# EAGLE design Satellite (EAGLE 5.11)
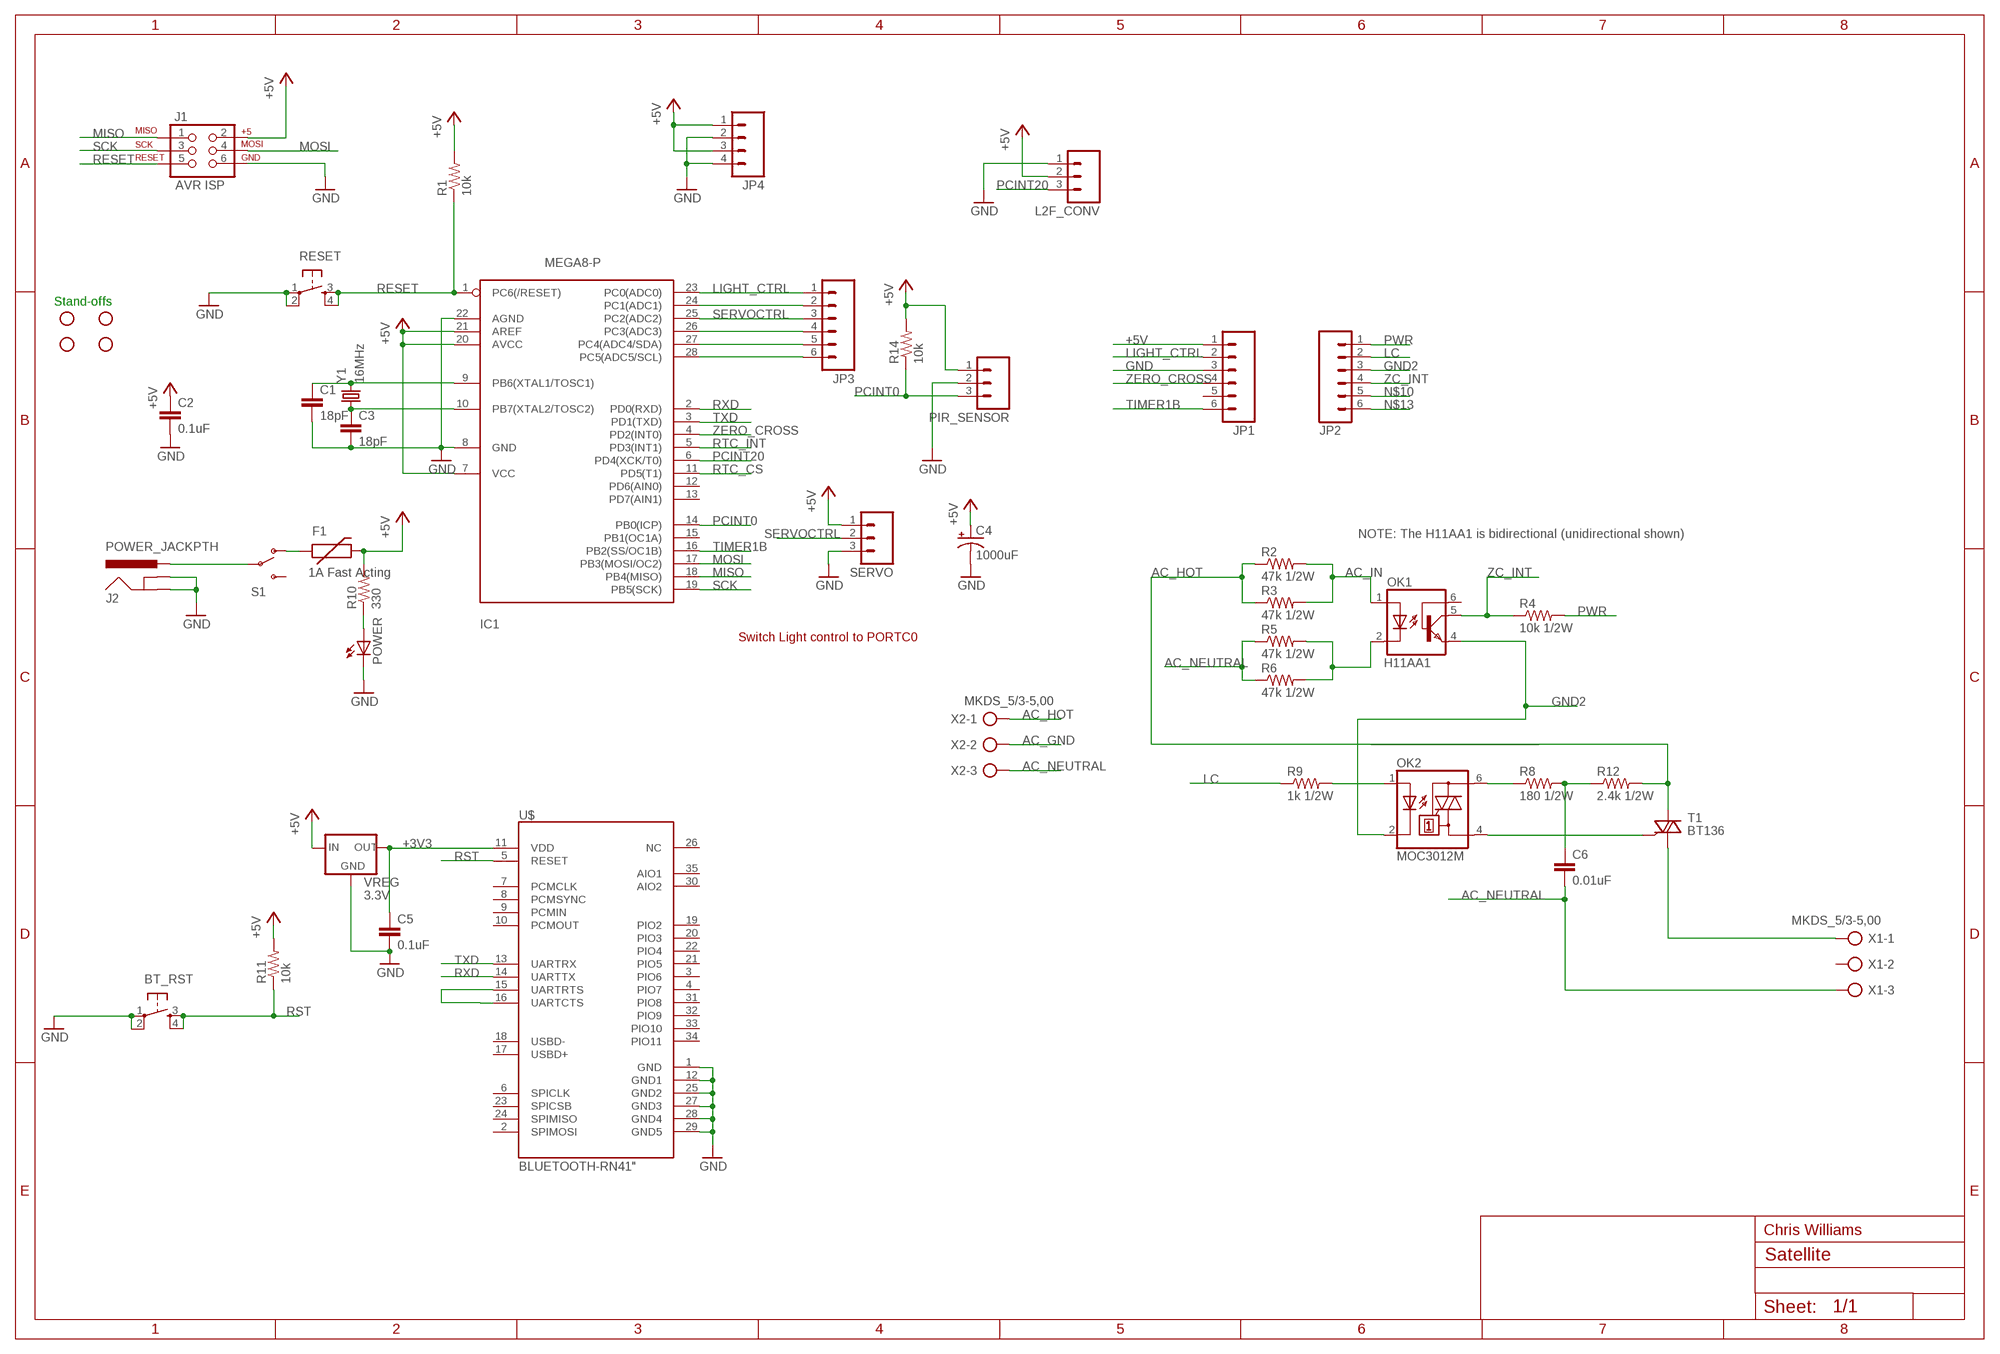
[diagram p0: schematic, sheet 1]

## Parts
BT_RST  TAC_SWITCHPTH  [TACTILE-PTH]
C1  18pF  CAPPTH2  [CAP-PTH-SMALL2]
C2  0.1uF  CAPPTH2  [CAP-PTH-SMALL2]
C3  18pF  CAPPTH2  [CAP-PTH-SMALL2]
C4  1000uF  CPOL-USE7.5-16  [E7,5-16]
C5  0.1uF  CAPPTH2  [CAP-PTH-SMALL2]
C6  0.01uF  C5/5  [C5B5]
F1  1A Fast Acting  PTCPTH  [PTC]
IC1  MEGA8-P  [DIL28-3]
J1  AVR ISP  AVR_SPI_PRG_6PTH  [2X3]
J2  POWER_JACKPTH  [POWER_JACK_PTH]
JP1  M06SIP  [1X06]
JP2  M06SIP  [1X06]
JP3  M06SIP  [1X06]
JP4  M04PTH  [1X04]
JP5  STAND-OFF  [STAND-OFF]
JP6  STAND-OFF  [STAND-OFF]
JP7  STAND-OFF  [STAND-OFF]
JP8  STAND-OFF  [STAND-OFF]
L2F_CONV  M03PTH  [1X03]
OK1  4N25M  [DIL06]
OK2  MOC3012M  [DIL06]
PIR_SENSOR  M03PTH  [1X03]
POWER  LED3MM  [LED3MM]
R1  10k  RESISTORPTH-1/4W  [AXIAL-0.4]
R2  47k 1/2W  RESISTORPTH-1/2W  [AXIAL-0.5]
R3  47k 1/2W  RESISTORPTH-1/2W  [AXIAL-0.5]
R4  10k 1/2W  RESISTORPTH-1/2W  [AXIAL-0.5]
R5  47k 1/2W  RESISTORPTH-1/2W  [AXIAL-0.5]
R6  47k 1/2W  RESISTORPTH-1/2W  [AXIAL-0.5]
R8  180 1/2W  RESISTORPTH-1/2W  [AXIAL-0.5]
R9  1k 1/2W  RESISTORPTH-1/2W  [AXIAL-0.5]
R10  330  RESISTORPTH-1/4W  [AXIAL-0.4]
R11  10k  RESISTORPTH-1/4W  [AXIAL-0.4]
R12  2.4k 1/2W  RESISTORPTH-1/2W  [AXIAL-0.5]
R14  10k  RESISTORPTH-1/4W  [AXIAL-0.4]
RESET  TAC_SWITCHPTH  [TACTILE-PTH]
S1  SWITCH-SPSTKIT  [SWITCH-SPDT_KIT]
SERVO  M03PTH  [1X03]
T1  BT136  [TO220AB]
U$  BLUETOOTH-RN41"  [RN41]
VREG  3.3V  V_REG_78XXSIDE  [78XXL]
X1  MKDS_5/3-5,00  [MKDS_5/3-500]
X2  MKDS_5/3-5,00  [MKDS_5/3-500]
Y1  16MHz  CRYSTALHC49US  [HC49US]

## Nets
+3V3: C5.1 U$.11(VDD) VREG.OUT
+5V: C2.1 C4.+ F1.P$2 IC1.7(VCC) IC1.20(AVCC) IC1.21(AREF) J1.2 JP1.1 JP4.1 JP4.3 L2F_CONV.2 PIR_SENSOR.1 R1.P$2 R10.P$2 R11.P$2 R14.P$2 SERVO.1 VREG.IN
AC1 [AC_HOT]: OK2.6(A2) R8.P$1
AC2 [AC_HOT]: C6.1 R8.P$2 R12.P$1
AC_GND: X2.2
AC_HOT [AC_HOT]: R2.P$1 R3.P$1 R12.P$2 T1.2(A2) X2.1
AC_IN [AC_HOT]: OK1.1(A) R2.P$2 R3.P$2
AC_NEUTRAL [AC_HOT]: C6.2 R5.P$1 R6.P$1 X1.3 X2.3
AC_OUT [AC_HOT]: T1.1(A1) X1.1
GND: BT_RST.1 BT_RST.2 C1.2 C2.2 C3.2 C4.- C5.2 IC1.8(GND) IC1.22(AGND) J1.6 J2.GND J2.GNDBREAK JP1.3 JP4.2 JP4.4 L2F_CONV.1 PIR_SENSOR.2 POWER.K(C) RESET.1 RESET.2 SERVO.3 U$.1(GND) U$.12(GND1) U$.25(GND2) U$.27(GND3) U$.28(GND4) U$.29(GND5) VREG.GND
GND2: JP2.3 OK1.4(EMI) OK2.2(C)
LC: JP2.2 R9.P$1
LIGHT_CTRL: IC1.23(PC0(ADC0)) JP1.2 JP3.1
MISO: IC1.18(PB4(MISO)) J1.1
MOSI: IC1.17(PB3(MOSI/OC2)) J1.4
N$1: IC1.24(PC1(ADC1)) JP3.2
N$2: J2.PWR S1.2(P)
N$5: C3.1 IC1.10(PB7(XTAL2/TOSC2)) Y1.1
N$6: C1.1 IC1.9(PB6(XTAL1/TOSC1)) Y1.2
N$8: OK2.4(A1) T1.3(G)
N$10: JP2.5
N$13: JP2.6
N$15: IC1.26(PC3(ADC3)) JP3.4
N$18: F1.P$1 S1.1(O)
N$19: POWER.A R10.P$1
N$21: IC1.27(PC4(ADC4/SDA)) JP3.5
N$22: IC1.28(PC5(ADC5/SCL)) JP3.6
N$29: OK2.1(A) R9.P$2
NEUT_IN [AC_HOT]: OK1.2(C) R5.P$2 R6.P$2
PCINT0: IC1.14(PB0(ICP)) PIR_SENSOR.3 R14.P$1
PCINT20: IC1.6(PD4(XCK/T0)) L2F_CONV.3
PWR: JP2.1 R4.P$2
RESET: IC1.1(PC6(/RESET)) J1.5 R1.P$1 RESET.3 RESET.4
RST: BT_RST.3 BT_RST.4 R11.P$1 U$.5(RESET)
RTC_CS: IC1.11(PD5(T1))
RTC_INT: IC1.5(PD3(INT1))
RTS: U$.15(UARTRTS) U$.16(UARTCTS)
RXD: IC1.2(PD0(RXD)) U$.14(UARTTX)
SCK: IC1.19(PB5(SCK)) J1.3
SERVOCTRL: IC1.25(PC2(ADC2)) JP3.3 SERVO.2
TIMER1B: IC1.16(PB2(SS/OC1B)) JP1.6
TXD: IC1.3(PD1(TXD)) U$.13(UARTRX)
ZC_INT: JP2.4 OK1.5(COL) R4.P$1
ZERO_CROSS: IC1.4(PD2(INT0)) JP1.4
Unconnected: IC1.12(PD6(AIN0)) IC1.13(PD7(AIN1)) IC1.15(PB1(OC1A)) JP1.5 OK1.6(BAS) S1.3(S) U$.2(SPIMOSI) U$.3(PIO6) U$.4(PIO7) U$.6(SPICLK) U$.7(PCMCLK) U$.8(PCMSYNC) U$.9(PCMIN) U$.10(PCMOUT) U$.17(USBD+) U$.18(USBD-) U$.19(PIO2) U$.20(PIO3) U$.21(PIO5) U$.22(PIO4) U$.23(SPICSB) U$.24(SPIMISO) U$.26(NC) U$.30(AIO2) U$.31(PIO8) U$.32(PIO9) U$.33(PIO10) U$.34(PIO11) U$.35(AIO1) X1.2

## Notes on the sheet
- Stand-offs
- NOTE: The H11AA1 is bidirectional (unidirectional shown)
- Switch Light control to PORTC0
- H11AA1
- Chris Williams

## Library data of the parts
BT_RST RESET = SparkFun:TAC_SWITCH: Momentary Switch Button commonly used for reset or general input. Spark Fun Electronics SKU : COM-00097
C1-C3 C5 = SparkFun:CAP: Capacitor Standard 0603 ceramic capacitor, and 0.1" leaded capacitor.
C4 = rcl:CPOL-US: POLARIZED CAPACITOR, American symbol
C6 = capacitor-wima:C: CAPACITOR naming: grid - package width
F1 = SparkFun:PTC: Resettable Fuse PTC Resettable Fuse. Spark Fun Electronics SKU : COM-08357
IC1 = atmel:MEGA8-P: MICROCONTROLLER 8 Kbytes FLASH, 1 kbytes SRAM, 512 bytes EEPROM, USART, 4-channel 10 bit ADC, 2-channel 8 bit ADC Pin compatible with Atmega48, ATMega88, ATMega168 Source: avr.lbr
J1 = SparkFun:AVR_SPI_PRG_6: AVR ISP 6 Pin This is the reduced ISP connector for AVR programming. Common on Arduino. This footprint will take up less PCB space and can be used with a 10-pin to 6-pin adapter such as SKU: BOB-08508
J2 = SparkFun:POWER_JACK: Power Jack This is the standard 5.5mm barrel jack for power. The PTH is the most common, proven, reliable, footprint. All others are experimental. The Slot footprint only works if the mill layer is transmitted to the PCB fab house so be warned. Spark Fun Electronics SKU : PRT-00119. Mating wall wart : TOL-00298 (and others)
JP1-JP3 = SparkFun:M06: Header 6 Standard 6-pin 0.1" header. Use with straight break away headers (SKU : PRT-00116), right angle break away headers (PRT-00553), swiss pins (PRT-00743), machine pins (PRT-00117), and female headers (PRT-00115). Molex polarized connector foot print use with SKU : PRT-08094 with associated crimp pins and housings. NOTES ON THE VARIANTS LOCK and LOCK_LONGPADS... This footprint was designed to help hold the alignment of a through-hole component (i.e. 6-pin header) while soldering it into place. You may notice that each hole has been shifted either up or down by 0.005 of an inch from it's more standard position (which is a perfectly straight line). This slight alteration caused the pins (the squares in the middle) to touch the edges of the holes. Because they are alternating, it causes a "brace" to hold the component in place. 0.005 has proven to be the perfect amount of "off-center" position when using our standard breakaway headers. Although looks a little odd when you look at the bare footprint, once you have a header in there, the alteration is very hard to notice. Also, if you push a header all the way into place, it is covered up entirely on the bottom side. This idea of altering the position of holes to aid alignment will be further integrated into the Sparkfun Library for other footprints. It can help hold any component with 3 or more connection pins.
JP4 = SparkFun:M04: Header 4 Standard 4-pin 0.1" header. Use with straight break away headers (SKU : PRT-00116), right angle break away headers (PRT-00553), swiss pins (PRT-00743), machine pins (PRT-00117), and female headers (PRT-00115). Molex polarized connector foot print use with SKU : PRT-08231 with associated crimp pins and housings. 1MM SMD Version SKU: PRT-10208
JP5-JP8 = SparkFun:STAND-OFF: Stand Off This is the mechanical footprint for a #4 phillips button head screw. Use the keepout ring to avoid running the screw head into surrounding components. SKU : PRT-00447
L2F_CONV PIR_SENSOR SERVO = SparkFun:M03: Header 3 Standard 3-pin 0.1" header. Use with straight break away headers (SKU : PRT-00116), right angle break away headers (PRT-00553), swiss pins (PRT-00743), machine pins (PRT-00117), and female headers (PRT-00115). Molex polarized connector foot print use with SKU : PRT-08232 with associated crimp pins and housings.
OK1 = optocoupler:4N*?M: General Purpose 6-Pin Phototransistor Optocouplers Source: http://www.fairchildsemi.com/ds/4N/4N35-M.pdf; MPN: 4N25-M; OC_FARNELL: 1021349; OC_NEWARK: 98K9084
OK2 = optocoupler:MOC30*M: RANDOM-PHASE OPTOISOLATORS TRIAC DRIVER OUTPUT Source: http://www.fairchildsemi.com MOC3020-M.pdf; MF: FAIRCHILD SEMICONDUCTOR; MPN: MOC3012-M; OC_FARNELL: 1021364; OC_NEWARK: 72K8894
POWER = led:LED: LED OSRAM: - CHIPLED LG R971, LG N971, LY N971, LG Q971, LY Q971, LO R971, LY R971 LH N974, LH R974 LS Q976, LO Q976, LY Q976 LO Q996 - Hyper CHIPLED LW Q18S LB Q993, LB Q99A, LB R99A - SideLED LS A670, LO A670, LY A670, LG A670, LP A670 LB A673, LV A673, LT A673, LW A673 LH A674 LY A675 LS A676, LA A676, LO A676, LY A676, LW A676 LS A679, LY A679, LG A679 - Hyper Micro SIDELED® LS Y876, LA Y876, LO Y876, LY Y876 LT Y87S - SmartLED LW L88C, LW L88S LB L89C, LB L89S, LG L890 LS L89K, LO L89K, LY L89K LS L896, LA L896, LO L896, LY L896 - TOPLED LS T670, LO T670, LY T670, LG T670, LP T670 LSG T670, LSP T670, LSY T670, LOP T670, LYG T670 LG T671, LOG T671, LSG T671 LB T673, LV T673, LT T673, LW T673 LH T674 LS T676, LA T676, LO T676, LY T676, LB T676, LH T676, LSB T676, LW T676 LB T67C, LV T67C, LT T67C, LS T67K, LO T67K, LY T67K, LW E67C LS E67B, LA E67B, LO E67B, LY E67B, LB E67C, LV E67C, LT E67C LW T67C LS T679, LY T679, LG T679 LS T770, LO T770, LY T770, LG T770, LP T770 LB T773, LV T773, LT T773, LW T773 LH T774 LS E675, LA E675, LY E675, LS T675 LS T776, LA T776, LO T776, LY T776, LB T776 LHGB T686 LT T68C, LB T68C - Hyper Mini TOPLED® LB M676 - Mini TOPLED Santana® LG M470 LS M47K, LO M47K, LY M47K Source: http://www.osram.convergy.de LUXEON: - LUMILED® LXK2-PW12-R00, LXK2-PW12-S00, LXK2-PW14-U00, LXK2-PW14-V00 LXK2-PM12-R00, LXK2-PM12-S00, LXK2-PM14-U00 LXK2-PE12-Q00, LXK2-PE12-R00, LXK2-PE12-S00, LXK2-PE14-T00, LXK2-PE14-U00 LXK2-PB12-K00, LXK2-PB12-L00, LXK2-PB12-M00, LXK2-PB14-N00, LXK2-PB14-P00, LXK2-PB14-Q00 LXK2-PR12-L00, LXK2-PR12-M00, LXK2-PR14-Q00, LXK2-PR14-R00 LXK2-PD12-Q00, LXK2-PD12-R00, LXK2-PD12-S00 LXK2-PH12-R00, LXK2-PH12-S00 LXK2-PL12-P00, LXK2-PL12-Q00, LXK2-PL12-R00 Source: www.luxeon.com KINGBRIGHT: KA-3528ASYC Source: www.kingbright.com
R1-R6 R8-R12 R14 = SparkFun:RESISTOR: Resistor Basic schematic elements and footprints for 0603, 1206, and PTH resistors.
S1 = SparkFun:SWITCH-SPST: SPST Switch Simple slide switch. Spark Fun Electronics SKU : COM-00102
T1 = triac:BT136: Triac BT136 series E sensitive gate Source: http://www.nxp.com/acrobat_download/datasheets/BT136_SERIES_E_2.pdf
U$ = SparkFun:BLUETOOTH-RN41
VREG = SparkFun:V_REG_78XX: Voltage Regulator Standard 7805 5V regulator. IGO (Input Ground Output). Spark Fun Electronics SKU : COM-00107
X1 X2 = con-phoenix-mkds_5:MKDS_5/3-: MKDS 5/3-6,35 Source: PHOENIX CONTACT
Y1 = SparkFun:CRYSTAL: Crystals Various standard crystals. Proven footprints. Spark Fun Electronics SKU : COM-00534

## Net classes
1 AC_HOT: width 0.813 mm, clearance 0.381 mm

## Board
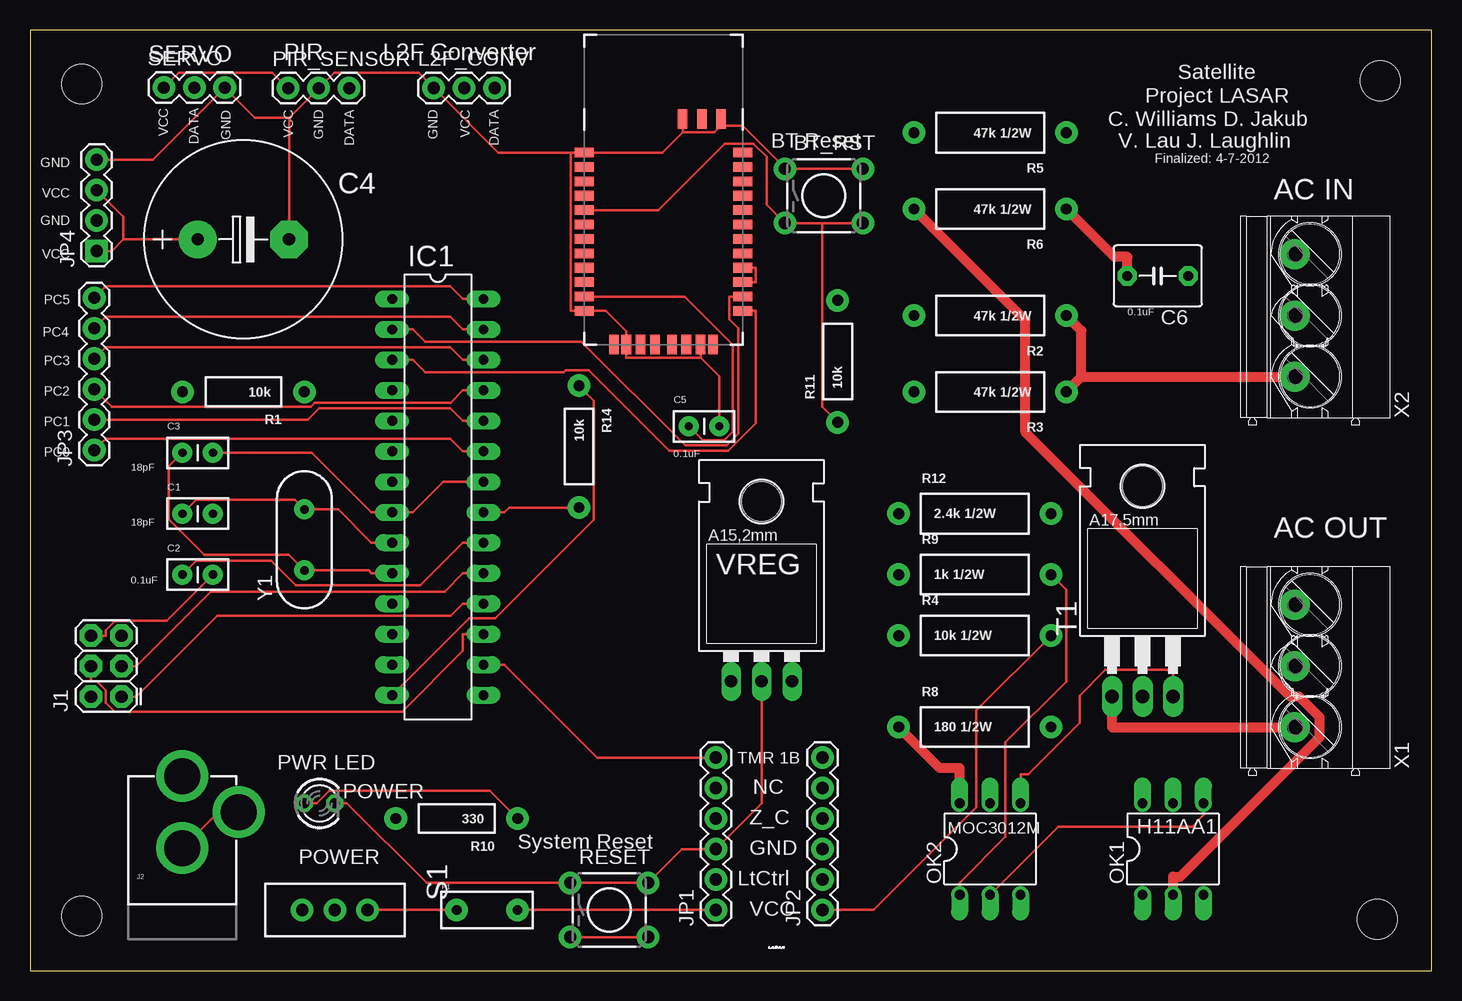
[diagram p1: board, top side]
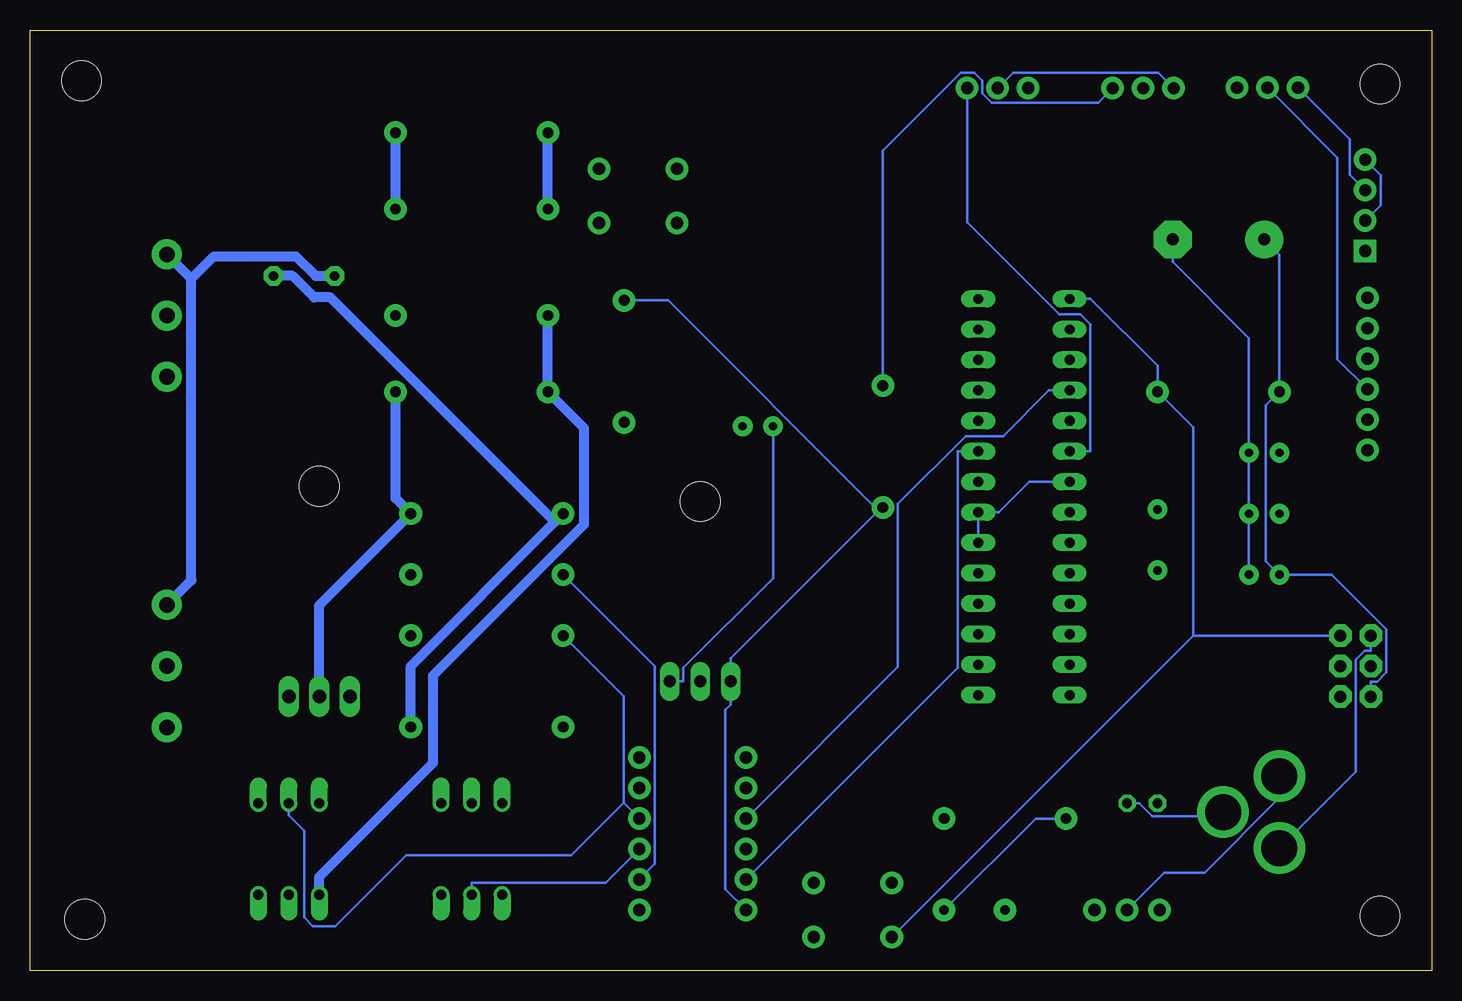
[diagram p2: board, bottom side, seen from below]

Size 116.82 x 78.41 mm. Coordinates in mm from the lower left corner, seen from the top.
Outline: 0,0 116.82,0 116.82,78.41 0,78.41 0,0
Copper layers (1*16): Top 0.035mm / dielectric 1.5mm / Bottom 0.035mm
Design rules "SparkFun": minimum track width 8mil, minimum drill 20mil, track to track 8mil, track to pad 8mil, pad to pad 8mil, via to via 8mil, smd to smd 8mil, copper to edge 10mil, drill to drill 8mil, minimum pad ring 12mil, minimum via ring 10mil, stop-mask expansion 4mil, vias tented up to drill 25mil, thermal gap 10mil

### Footprints (pad centres in the part's own frame; a part is rotated, then mirrored left to right if it is on the bottom)
TACTILE-PTH = drill 1.016 pad 1.88 round: 1 -3.251,2.261; 2 3.251,2.261; 3 -3.251,-2.261; 4 3.251,-2.261
CAP-PTH-SMALL2 = drill 0.7 pad 1.651 round: 1 0,0; 2 2.54,0
E7,5-16 = drill 1.016 pad 3.15 round: + -3.81,0 | drill 1.016 pad 3.15 octagon: - 3.81,0
C5B5 = drill 0.813 pad 1.6 octagon: 1 -2.54,0; 2 2.54,0
PTC = drill 0.8 pad 1.88 round: P$1 -2.54,0; P$2 2.54,0
DIL28-3 = drill 0.813 long: 1 -16.51,-3.81; 2 -13.97,-3.81; 3 -11.43,-3.81; 4 -8.89,-3.81; 5 -6.35,-3.81; 6 -3.81,-3.81; 7 -1.27,-3.81; 8 1.27,-3.81; 9 3.81,-3.81; 10 6.35,-3.81; 11 8.89,-3.81; 12 11.43,-3.81; 13 13.97,-3.81; 14 16.51,-3.81; 15 16.51,3.81; 16 13.97,3.81; 17 11.43,3.81; 18 8.89,3.81; 19 6.35,3.81; 20 3.81,3.81; 21 1.27,3.81; 22 -1.27,3.81; 23 -3.81,3.81; 24 -6.35,3.81; 25 -8.89,3.81; 26 -11.43,3.81; 27 -13.97,3.81; 28 -16.51,3.81
2X3 = drill 1.016 pad 1.88 octagon: 1 0,0; 2 0,2.54; 3 2.54,0; 4 2.54,2.54; 5 5.08,0; 6 5.08,2.54
POWER_JACK_PTH = drill 2.997 pad 4.318 round: GND 0,7.7; GNDBREAK 4.7,10.7; PWR 0,13.7
1X06 = drill 1.016 pad 1.88 round: 1 0,0; 2 2.54,0; 3 5.08,0; 4 7.62,0; 5 10.16,0; 6 12.7,0
1X04 = drill 1.016 pad 1.88 square: 1 0,0 | drill 1.016 pad 1.88 round: 2 2.54,0; 3 5.08,0; 4 7.62,0
STAND-OFF = hole 3.302: 0,0
1X03 = drill 1.016 pad 1.88 round: 1 0,0; 2 2.54,0; 3 5.08,0
DIL06 = drill 0.813 offset: 1 -2.54,-3.81; 2 0,-3.81; 3 2.54,-3.81; 4 2.54,3.81; 5 0,3.81; 6 -2.54,3.81
LED3MM = drill 0.813 octagon: A -1.27,0; K 1.27,0
AXIAL-0.4 = drill 0.9 pad 1.88 round: P$1 -5.08,0; P$2 5.08,0
AXIAL-0.5 = drill 0.9 pad 1.88 round: P$1 -6.35,0; P$2 6.35,0
SWITCH-SPDT_KIT = drill 1.016 pad 1.88 round: 1 0,2.718; 2 0,0; 3 0,-2.718
TO220AB = drill 1.118 long: 1 -2.54,-6.35; 2 0,-6.35; 3 2.54,-6.35 | hole 3.302: 0,11.176
RN41 = smd 0.8 x 1.6: 1 -6.6,-6.6; 2 -5.4,-6.6; 3 -4.2,-6.6; 4 -3,-6.6; 5 -1.8,-6.6; 6 -0.6,-6.6; 7 0.6,-6.6; 8 1.8,-6.6; 9 3,-6.6; 10 4.2,-6.6; 11 5.4,-6.6; 12 6.6,-6.6; 13 6.6,6.6; 14 5.4,6.6; 15 4.2,6.6; 16 3,6.6; 17 1.8,6.6; 18 0.6,6.6; 19 -0.6,6.6; 20 -1.8,6.6; 21 -3,6.6; 22 -4.2,6.6; 23 -5.4,6.6; 24 -6.6,6.6 | smd 1.6 x 0.8: 25 -9.4,4.8; 26 -9.4,3.2; 27 -9.4,1.6; 28 9.4,3.1; 29 9.4,-3.1; 30 9.4,-4.122; 31 9.4,-1.9; 32 9.4,-0.7; 33 9.4,0.7; 34 9.4,1.9; 35 9.4,4.122
78XXL = drill 1.016 long: GND 0,-3.81; IN -2.54,-3.81; OUT 2.54,-3.81 | hole 3.302: 0,11.176
MKDS_5/3-500 = drill 1.3 pad 2.5 round: 1 -5.1,1.27; 2 0,1.27; 3 5.1,1.27
HC49US = drill 0.7 pad 1.651 round: 1 -2.54,0; 2 2.54,0

### Placement (x,y rotation side)
BT_RST  66.15,64.58 0 top
C1  12.7,38.1 0 top
C2  12.7,33.02 0 top
C3  12.7,43.18 0 top
C4  17.78,60.96 0 top
C5  54.9,45.39 0 top
C6  93.98,57.91 180 top
F1  38.1,5.08 0 top
IC1  33.99,39.49 270 top
J1  7.62,22.86 90 top
J2  12.7,2.54 0 top
JP1  57.15,5.08 90 top
JP2  66.04,5.08 90 top
JP3  5.35,43.39 90 top
JP4  5.56,59.99 90 top
JP5  112.52,74.17 0 top
JP6  4.32,73.91 0 top
JP7  112.27,4.32 0 top
JP8  4.32,4.57 0 top
L2F_CONV  33.64,73.58 0 top
OK1  95.25,10.16 0 top
OK2  80.01,10.16 0 top
PIR_SENSOR  21.51,73.56 0 top
POWER  24.13,13.97 0 top
R1  17.78,48.26 180 top
R2  80.01,54.61 180 top
R3  80.01,48.26 180 top
R4  78.74,27.94 0 top
R5  80.01,69.85 180 top
R6  80.01,63.5 180 top
R8  78.74,20.32 0 top
R9  78.74,33.02 0 top
R10  35.56,12.7 180 top
R11  67.31,50.8 90 top
R12  78.74,38.1 0 top
R14  45.75,43.7 270 top
RESET  48.26,5.08 0 top
S1  25.4,5.08 270 top
SERVO  11.15,73.61 0 top
T1  92.71,29.21 0 top
U$  52.79,61.6 270 top
VREG  60.96,27.94 0 top
X1  106.68,25.4 90 top
X2  106.68,54.61 90 top
Y1  22.86,35.92 90 top

### Tracks (layer width: path | path; a pad name or v marks a point on that pad's centre or on a via)
+3V3
  Top 0.203: U$.11 54.54,56.2 58.57,52.16 58.57,44.92 57.86,44.21 56.08,44.21 C5.1
  Bottom 0.203: VREG.OUT 62.38,24.13 62.38,25.25 54.9,32.73 C5.1
+5V
  Top 0.203: IC1.21 39.52,38.22 39.92,38.62 R14.P$2 | C2.1 13.86,34.18 20.11,34.18 22.16,32.13 32.51,32.13 36.07,35.68 IC1.20 | SERVO.1 12.41,74.87 20.2,74.87 PIR_SENSOR.1 | C4.+ 7.78,60.96 | 7.78,60.96 6.8,59.99 JP4.1 | 7.78,60.96 7.78,62.85 JP4.3 | JP1.1 F1.P$2
  Bottom 0.203: IC1.20 IC1.21 36.07,38.22 33.53,40.76 IC1.7 | J1.2 5.08,24.11 4.56,24.11 3.79,24.88 3.79,28.47 8.33,33.02 C2.1 13.84,34.16 13.84,47.12 R1.P$2 12.7,59.69 C4.+ | F1.P$2 33.02,12.7 R10.P$2 | PIR_SENSOR.1 22.82,74.86 34.9,74.86 L2F_CONV.2 | 46.37,38.62 46.37,38.11 58.42,26.06 VREG.IN 58.42,22.2 58.88,21.74 58.88,6.81 JP1.1 | R11.P$2 63.63,55.88 46.37,38.62 | R14.P$2 46.37,38.62 | SERVO.1 6.85,69.31 6.85,66.36 JP4.3
AC1
  Top 0.813: OK2.6 77.47,16.89 75.82,16.89 R8.P$1
AC2
  Bottom 0.813: 73.07,37.42 85.09,25.4 R8.P$2 | 73.07,37.42 R12.P$1 | 73.07,37.42 91.78,56.13 93.15,56.13 94.93,57.91 C6.1
AC_HOT
  Top 0.813: R3.P$1 87.61,49.51 | 87.61,49.51 X2.1 | 87.61,49.51 87.61,53.36 R2.P$1
  Bottom 0.813: T1.2 92.71,30.48 R12.P$2 86.36,39.37 R3.P$1
AC_IN
  Bottom 0.813: OK1.1 92.71,7.85 83.22,17.34 83.22,24.63 70.64,37.21 70.64,45.24 R3.P$2 R2.P$2
AC_NEUTRAL
  Top 0.813: C6.2 91.44,59.5 90.36,59.5 R6.P$1
  Bottom 0.813: 103.37,57.67 X2.3 | X1.3 103.37,32.54 103.37,57.67 | 103.37,57.67 101.5,59.54 94.66,59.54 93.03,57.91 C6.2 | R6.P$1 R5.P$1
AC_OUT
  Top 0.813: T1.1 90.17,20.34 90.22,20.3 X1.1
GND
  Top 0.203: 21.59,71.09 PIR_SENSOR.2 25.34,74.85 32.38,74.85 L2F_CONV.1 39.03,68.19 45.08,68.19 | C4.- 21.59,71.09 | 21.59,71.09 18.75,71.09 SERVO.3 10.23,67.61 JP4.4 | 45.08,68.19 U$.1 52.69,68.19 54.39,69.89 | 45.08,68.19 45.08,54.99 U$.12 47.99,54.99 49.69,53.3 U$.29 49.69,51.09 55.89,51.09 | 54.39,69.89 57.03,69.89 57.59,70.44 | 54.39,69.89 54.39,69.99 U$.27 | J2.GNDBREAK 15.7,13.24 J2.GND | POWER.K 26.42,13.97 33.05,7.34 RESET.1 RESET.2 54.33,10.16 JP1.3 60.96,13.97 VREG.GND | IC1.22 34.45,40.76 31.91,38.22 IC1.8 28.45,38.22 23.49,43.18 C3.2 | 57.59,70.44 59.38,70.44 62.9,66.92 BT_RST.1 BT_RST.2 | 55.89,51.09 57.44,49.54 C5.2 | 55.89,51.09 U$.28 | 57.59,70.44 U$.25 | J1.6 6.33,27.94 6.33,28.41 7.1,29.18 11.4,29.18 C2.2
  Bottom 0.203: J1.6 5.08,26.7 5.6,26.7 6.35,25.94 6.35,16.59 J2.GND | C2.2 C1.2 C3.2 15.24,52.73 21.59,59.08 C4.- | POWER.K 24.38,13.97 23.3,12.88 17.76,12.88 J2.GNDBREAK | JP4.4 4.26,66.31 4.26,63.82 JP4.2
GND2
  Top 0.203: OK1.4 97.79,12.95 96.86,12.02 85.68,12.02 OK2.2
  Bottom 0.203: OK2.2 80.01,7.37 68.83,7.37 JP2.3
LC
  Bottom 0.203: R9.P$1 64.75,25.38 64.75,8.91 JP2.2
LIGHT_CTRL
  Top 0.203: IC1.23 36.07,43.3 35.02,44.35 6.31,44.35 JP3.1
  Bottom 0.203: IC1.23 39.52,43.3 39.52,25.25 JP1.2
MISO
  Top 0.203: IC1.18 36.07,30.6 35.05,29.59 15.59,29.59 8.87,22.86 J1.1
MOSI
  Top 0.203: IC1.17 36.07,28.06 36.07,26.67 31.01,21.61 7.07,21.61 6.33,22.36 6.33,23.38 5.55,24.16 5.08,24.16 J1.4
N$1
  Top 0.203: JP3.2 23.15,45.93 24.11,46.89 35.02,46.89 36.07,45.84 IC1.24
N$2
  Bottom 0.203: S1.2 22.31,8.17 18.94,8.17 12.7,14.42 J2.PWR
N$5
  Top 0.203: C3.1 11.56,42.04 11.56,37.63 14.53,34.67 21.57,34.67 Y1.1 28.21,33.38 28.45,33.14 IC1.10
N$6
  Top 0.203: IC1.9 28.45,35.68 25.67,38.46 Y1.2 22.05,39.27 13.87,39.27 C1.1
N$8
  Top 0.203: OK2.4 82.55,16.41 83.19,16.41 87.48,20.69 87.48,22.94 89.62,25.08 95.06,25.08 95.25,24.89 T1.3
N$15
  Top 0.203: IC1.26 36.07,50.92 35.02,51.97 6.31,51.97 JP3.4
N$18
  Top 0.203: S1.1 F1.P$1
N$19
  Top 0.203: POWER.A 23.88,13.97 24.93,15.02 38.32,15.02 R10.P$1
N$21
  Top 0.203: IC1.27 36.07,53.46 35.02,54.51 6.31,54.51 JP3.5
N$22
  Top 0.203: IC1.28 36.07,56 35,57.07 6.33,57.07 JP3.6
N$29
  Top 0.203: OK2.1 77.47,7.37 81.28,11.18 81.28,19.04 86.35,24.11 86.35,31.76 R9.P$2
NEUT_IN
  Top 0.813: OK1.2 95.25,7.85 95.87,7.85 107.48,19.45 107.48,21.14 105.77,22.85 105,22.85 82.95,44.91 82.95,54.21 R6.P$2
  Bottom 0.813: R6.P$2 R5.P$2
PCINT0
  Top 0.203: R14.P$1 46.99,47.53 46.99,37.62 38.78,29.41 36.6,29.41 IC1.14
  Bottom 0.203: R14.P$1 45.75,68.33 39.24,74.84 38.15,74.84 37.48,74.17 37.48,73.12 36.69,72.33 27.82,72.33 PIR_SENSOR.3
PCINT20
  Bottom 0.203: IC1.6 28.45,43.3 28.45,53.89 29.29,54.73 31.06,54.73 38.72,62.39 L2F_CONV.3
PWR
  Top 0.203: R4.P$2 78.87,21.72 78.87,13.63 70.31,5.08 JP2.1
RESET
  Top 0.203: RESET.3 RESET.4
  Bottom 0.203: J1.5 19.89,27.94 | 19.89,27.94 RESET.3 | 19.89,27.94 19.89,45.29 R1.P$1 22.86,50.41 28.45,56 IC1.1
RST
  Top 0.203: U$.5 52.34,63.4 57.88,68.94 60.28,68.94 61.38,67.84 61.38,63.85 BT_RST.3 66.03,62.32 | 66.03,62.32 BT_RST.4 | 66.03,62.32 66.03,47 R11.P$1
RTS
  Top 0.203: U$.15 60.49,57.4 60.49,58.59 U$.16
RXD
  Top 0.203: IC1.2 31.91,53.46 32.92,52.45 45.95,52.45 54.6,43.8 58.05,43.8 59.02,44.77 59.02,53.55 58.28,54.29 58.28,56.2 U$.14
SCK
  Top 0.203: IC1.19 36.07,33.14 34.55,31.62 15.08,31.62 8.87,25.4 J1.3
SERVOCTRL
  Top 0.203: IC1.25 36.07,48.38 35.05,47.37 23.73,47.37 23.38,47.02 6.81,47.02 JP3.3
  Bottom 0.203: SERVO.2 7.86,67.78 7.86,50.98 JP3.3
TIMER1B
  Top 0.203: IC1.16 39.52,25.52 47.27,17.78 JP1.6
TXD
  Top 0.203: IC1.3 31.91,50.92 32.93,49.89 44.49,49.89 44.65,50.05 46.56,50.05 53.25,43.36 58.19,43.36 60.49,45.66 60.49,54.99 U$.13
ZC_INT
  Bottom 0.203: OK1.5 95.25,12.95 93.98,11.68 93.98,4.46 93.24,3.72 91.36,3.72 85.45,9.63 71.7,9.63 67.33,13.99 | JP2.4 67.33,13.99 | R4.P$1 67.33,22.89 67.33,13.99
ZERO_CROSS
  Bottom 0.203: IC1.4 31.91,48.38 35.72,44.57 38.85,44.57 44.5,38.92 44.5,25.35 JP1.4

### Text on the board
tPlace: SERVO | PIR | L2F Converter | Satellite | VCC | DATA | GND | VCC | GND | DATA | GND | VCC | DATA | Project LASAR | C. Williams D. Jakub | BT Reset | V. Lau J. Laughlin | GND | Finalized: 4-7-2012 | VCC | AC IN | GND | VCC | PC5 | 0.1uF | PC4 | PC3 | PC2 | PC1 | PC0 | 0.1uF | 18pF | 18pF | AC OUT | 0.1uF | PWR LED | TMR 1B | NC | Z_C | MOC3012M | H11AA1 | System Reset | GND | POWER | LtCtrl | VCC